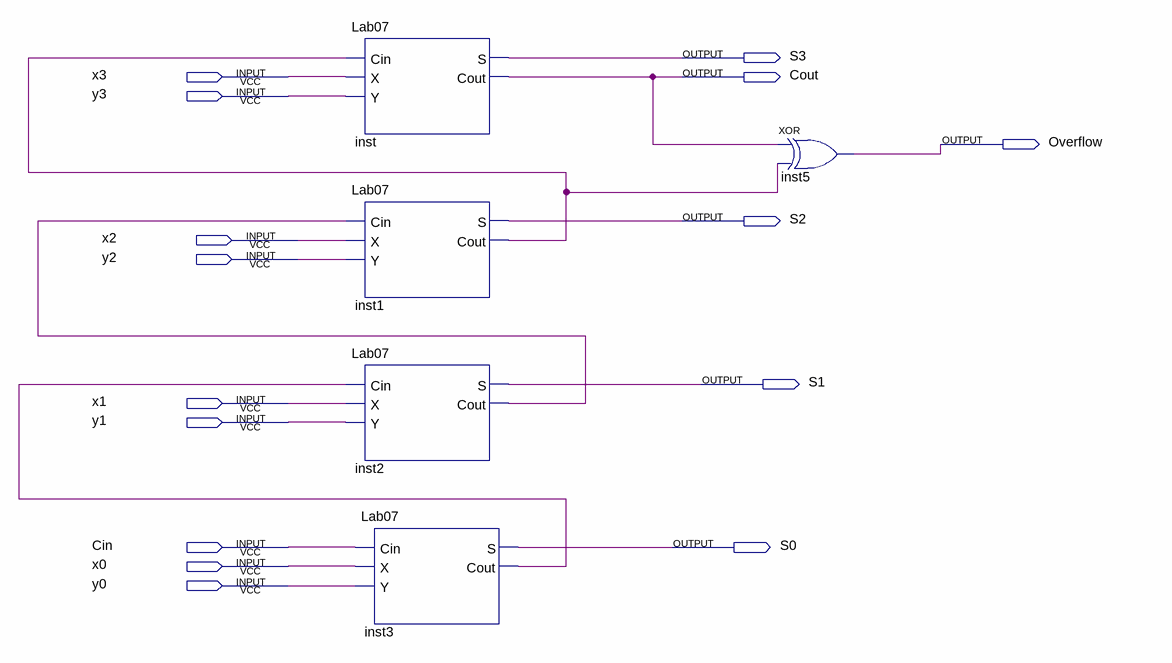
[diagram p0: schematic sheet]
// Quartus schematic Lab07step1.bdf as structural Verilog: 5 symbols, 15 pins
module Lab07step1 (
  input  x3,
  input  y3,
  input  x2,
  input  y2,
  input  x1,
  input  y1,
  input  Cin,
  input  x0,
  input  y0,
  output S3,
  output Cout,
  output Overflow,
  output S2,
  output S1,
  output S0
);

  wire inst1_cout, inst2_cout, inst3_cout;

  Lab07 inst (.Cin(inst1_cout), .X(x3), .Y(y3), .S(S3), .Cout(Cout));
  Lab07 inst1 (.Cin(inst2_cout), .X(x2), .Y(y2), .S(S2), .Cout(inst1_cout));
  Lab07 inst2 (.Cin(inst3_cout), .X(x1), .Y(y1), .S(S1), .Cout(inst2_cout));
  Lab07 inst3 (.Cin(Cin), .X(x0), .Y(y0), .S(S0), .Cout(inst3_cout));
  xor inst5 (Overflow, Cout, inst1_cout);
endmodule
